# Altium project RunIN MuMux V1R0.PrjPcb
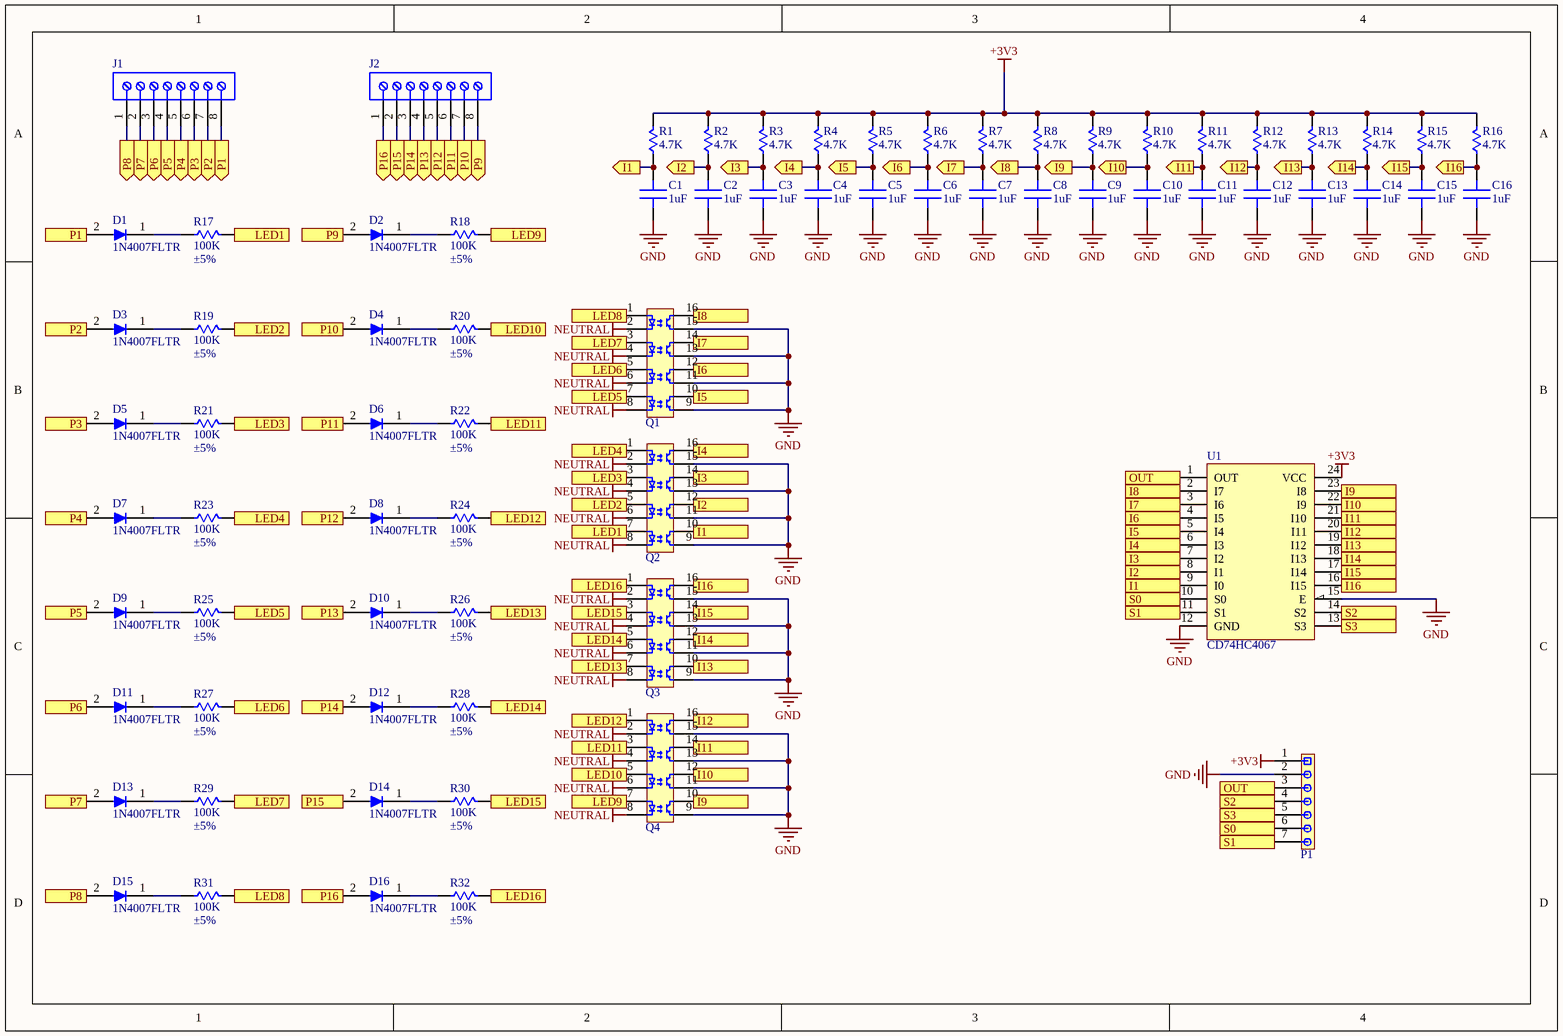
[diagram p0: MuMux V1R0.SchDoc]
1 sheet, 72 parts. Net scope: flat (ports and power ports of the same name join across sheets).
Board file: MuMux V1R0.PcbDoc

## Sheet MuMux V1R0.SchDoc
size A4; SheetNumber: 1; SheetTotal: 1

### Parts
C1  1uF  [0402-CAP]
C2  1uF  [0402-CAP]
C3  1uF  [0402-CAP]
C4  1uF  [0402-CAP]
C5  1uF  [0402-CAP]
C6  1uF  [0402-CAP]
C7  1uF  [0402-CAP]
C8  1uF  [0402-CAP]
C9  1uF  [0402-CAP]
C10  1uF  [0402-CAP]
C11  1uF  [0402-CAP]
C12  1uF  [0402-CAP]
C13  1uF  [0402-CAP]
C14  1uF  [0402-CAP]
C15  1uF  [0402-CAP]
C16  1uF  [0402-CAP]
D1  1N4007FLTR  [SOD-123F]
D2  1N4007FLTR  [SOD-123F]
D3  1N4007FLTR  [SOD-123F]
D4  1N4007FLTR  [SOD-123F]
D5  1N4007FLTR  [SOD-123F]
D6  1N4007FLTR  [SOD-123F]
D7  1N4007FLTR  [SOD-123F]
D8  1N4007FLTR  [SOD-123F]
D9  1N4007FLTR  [SOD-123F]
D10  1N4007FLTR  [SOD-123F]
D11  1N4007FLTR  [SOD-123F]
D12  1N4007FLTR  [SOD-123F]
D13  1N4007FLTR  [SOD-123F]
D14  1N4007FLTR  [SOD-123F]
D15  1N4007FLTR  [SOD-123F]
D16  1N4007FLTR  [SOD-123F]
J1  691210910008  [691210910008]  (value not drawn)
J2  691210910008  [691210910008]  (value not drawn)
P1  M20-9990746  [61300711121]  (value not drawn)
Q1  LTV-846S  [LTV-846S]  (value not drawn)
Q2  LTV-846S  [LTV-846S]  (value not drawn)
Q3  LTV-846S  [LTV-846S]  (value not drawn)
Q4  LTV-846S  [LTV-846S]  (value not drawn)
R1  4.7K  [0402-RES]
R2  4.7K  [0402-RES]
R3  4.7K  [0402-RES]
R4  4.7K  [0402-RES]
R5  4.7K  [0402-RES]
R6  4.7K  [0402-RES]
R7  4.7K  [0402-RES]
R8  4.7K  [0402-RES]
R9  4.7K  [0402-RES]
R10  4.7K  [0402-RES]
R11  4.7K  [0402-RES]
R12  4.7K  [0402-RES]
R13  4.7K  [0402-RES]
R14  4.7K  [0402-RES]
R15  4.7K  [0402-RES]
R16  4.7K  [0402-RES]
R17  100K  Tolerance: ±5%  [FMP200JR-52-100K]
R18  100K  Tolerance: ±5%  [FMP200JR-52-100K]
R19  100K  Tolerance: ±5%  [FMP200JR-52-100K]
R20  100K  Tolerance: ±5%  [FMP200JR-52-100K]
R21  100K  Tolerance: ±5%  [FMP200JR-52-100K]
R22  100K  Tolerance: ±5%  [FMP200JR-52-100K]
R23  100K  Tolerance: ±5%  [FMP200JR-52-100K]
R24  100K  Tolerance: ±5%  [FMP200JR-52-100K]
R25  100K  Tolerance: ±5%  [FMP200JR-52-100K]
R26  100K  Tolerance: ±5%  [FMP200JR-52-100K]
R27  100K  Tolerance: ±5%  [FMP200JR-52-100K]
R28  100K  Tolerance: ±5%  [FMP200JR-52-100K]
R29  100K  Tolerance: ±5%  [FMP200JR-52-100K]
R30  100K  Tolerance: ±5%  [FMP200JR-52-100K]
R31  100K  Tolerance: ±5%  [FMP200JR-52-100K]
R32  100K  Tolerance: ±5%  [FMP200JR-52-100K]
U1  CD74HC4067  [SOIC-24]

### Ports
I1 (in, see MuMux V1R0[2A], MuMux V1R0[2C]), I1 (out, see MuMux V1R0[2A], MuMux V1R0[3C]), I1 (out, see MuMux V1R0[2C], MuMux V1R0[3C]), I2 (in, see MuMux V1R0[2A], MuMux V1R0[2B]), I2 (out, see MuMux V1R0[2A], MuMux V1R0[3C]), I2 (out, see MuMux V1R0[2B], MuMux V1R0[3C]), I3 (in, see MuMux V1R0[2A], MuMux V1R0[2B]), I3 (out, see MuMux V1R0[2A], MuMux V1R0[3C]), I3 (out, see MuMux V1R0[2B], MuMux V1R0[3C]), I4 (in, see MuMux V1R0[2A], MuMux V1R0[2B]), I4 (out, see MuMux V1R0[2A], MuMux V1R0[3C]), I4 (out, see MuMux V1R0[2B], MuMux V1R0[3C]), I5 (in, see MuMux V1R0[2B], MuMux V1R0[3A]), I5 (out, see MuMux V1R0[2B], MuMux V1R0[3C]), I5 (out, see MuMux V1R0[3A], MuMux V1R0[3C]), I6 (in, see MuMux V1R0[2B], MuMux V1R0[3A]), I6 (out, see MuMux V1R0[2B], MuMux V1R0[3C]), I6 (out, see MuMux V1R0[3A], MuMux V1R0[3C]), I7 (in, see MuMux V1R0[2B], MuMux V1R0[3A]), I7 (out, see MuMux V1R0[2B], MuMux V1R0[3B]), I7 (out, see MuMux V1R0[3A], MuMux V1R0[3B]), I8 (in, see MuMux V1R0[2B], MuMux V1R0[3A]), I8 (out, see MuMux V1R0[2B], MuMux V1R0[3B]), I8 (out, see MuMux V1R0[3A], MuMux V1R0[3B]), I9 (in, see MuMux V1R0[2D], MuMux V1R0[3A]), I9 (out, see MuMux V1R0[2D], MuMux V1R0[4B]), I9 (out, see MuMux V1R0[3A], MuMux V1R0[4B]), I10 (in, see MuMux V1R0[2D], MuMux V1R0[3A]), I10 (out, see MuMux V1R0[2D], MuMux V1R0[4B]), I10 (out, see MuMux V1R0[3A], MuMux V1R0[4B]), I11 (in, see MuMux V1R0[2C], MuMux V1R0[3A]), I11 (out, see MuMux V1R0[2C], MuMux V1R0[4C]), I11 (out, see MuMux V1R0[3A], MuMux V1R0[4C]), I12 (in, see MuMux V1R0[2C], MuMux V1R0[4A]), I12 (out, see MuMux V1R0[2C], MuMux V1R0[4C]), I12 (out, see MuMux V1R0[4A], MuMux V1R0[4C]), I13 (in, see MuMux V1R0[2C], MuMux V1R0[4A]), I13 (out, see MuMux V1R0[2C], MuMux V1R0[4C]), I13 (out, see MuMux V1R0[4A], MuMux V1R0[4C]), I14 (in, see MuMux V1R0[2C], MuMux V1R0[4A]), I14 (out, see MuMux V1R0[2C], MuMux V1R0[4C]), I14 (out, see MuMux V1R0[4A], MuMux V1R0[4C]), I15 (in, see MuMux V1R0[2C], MuMux V1R0[4A]), I15 (out, see MuMux V1R0[2C], MuMux V1R0[4C]), I15 (out, see MuMux V1R0[4A], MuMux V1R0[4C]), I16 (in, see MuMux V1R0[2C], MuMux V1R0[4A]), I16 (out, see MuMux V1R0[2C], MuMux V1R0[4C]), I16 (out, see MuMux V1R0[4A], MuMux V1R0[4C]), LED1 (in, see MuMux V1R0[1A]), LED1 (out, see MuMux V1R0[2C]), LED2 (in, see MuMux V1R0[1B]), LED2 (out, see MuMux V1R0[2B]), LED3 (in, see MuMux V1R0[1B]), LED3 (out, see MuMux V1R0[2B]), LED4 (in, see MuMux V1R0[1C]), LED4 (out, see MuMux V1R0[2B]), LED5 (in, see MuMux V1R0[1C]), LED5 (out, see MuMux V1R0[2B]), LED6 (in, see MuMux V1R0[1C]), LED6 (out, see MuMux V1R0[2B]), LED7 (in, see MuMux V1R0[1D]), LED7 (out, see MuMux V1R0[2B]), LED8 (in, see MuMux V1R0[1D]), LED8 (out, see MuMux V1R0[2B]), LED9 (in, see MuMux V1R0[2A]), LED9 (out, see MuMux V1R0[2D]), LED10 (in, see MuMux V1R0[2B]), LED10 (out, see MuMux V1R0[2D]), LED11 (in, see MuMux V1R0[2B]), LED11 (out, see MuMux V1R0[2C]), LED12 (in, see MuMux V1R0[2C]), LED12 (out, see MuMux V1R0[2C]), LED13 (in, see MuMux V1R0[2C]), LED13 (out, see MuMux V1R0[2C]), LED14 (in, see MuMux V1R0[2C]), LED14 (out, see MuMux V1R0[2C]), LED15 (in, see MuMux V1R0[2D]), LED15 (out, see MuMux V1R0[2C]), LED16 (in, see MuMux V1R0[2D]), LED16 (out, see MuMux V1R0[2C]), OUT (out, see MuMux V1R0[3B]), OUT (out, see MuMux V1R0[4D]), P1 (in, see MuMux V1R0[1A]), P1 (out, see MuMux V1R0[1A]), P2 (in, see MuMux V1R0[1A]), P2 (out, see MuMux V1R0[1B]), P3 (in, see MuMux V1R0[1A]), P3 (out, see MuMux V1R0[1B]), P4 (in, see MuMux V1R0[1A]), P4 (out, see MuMux V1R0[1C]), P5 (in, see MuMux V1R0[1A]), P5 (out, see MuMux V1R0[1C]), P6 (in, see MuMux V1R0[1A]), P6 (out, see MuMux V1R0[1C]), P7 (in, see MuMux V1R0[1A]), P7 (out, see MuMux V1R0[1D]), P8 (in, see MuMux V1R0[1A]), P8 (out, see MuMux V1R0[1D]), P9 (in, see MuMux V1R0[2A]), P9 (out, see MuMux V1R0[1A]), P10 (in, see MuMux V1R0[2A]), P10 (out, see MuMux V1R0[1B]), P11 (in, see MuMux V1R0[2A]), P11 (out, see MuMux V1R0[1B]), P12 (in, see MuMux V1R0[2A]), P12 (out, see MuMux V1R0[1C]), P13 (in, see MuMux V1R0[2A]), P13 (out, see MuMux V1R0[1C]), P14 (in, see MuMux V1R0[2A]), P14 (out, see MuMux V1R0[1C]), P15 (in, see MuMux V1R0[2A]), P15 (out, see MuMux V1R0[1D]), P16 (in, see MuMux V1R0[1A]), P16 (out, see MuMux V1R0[1D]), S0 (in, see MuMux V1R0[4D]), S0 (out, see MuMux V1R0[3C]), S1 (in, see MuMux V1R0[4D]), S1 (out, see MuMux V1R0[3C]), S2 (in, see MuMux V1R0[4D]), S2 (out, see MuMux V1R0[4C]), S3 (in, see MuMux V1R0[4D]), S3 (out, see MuMux V1R0[4C])

### Nets
+3V3: P1.1 R1.2 R2.2 R3.2 R4.2 R5.2 R6.2 R7.2 R8.2 R9.2 R10.2 R11.2 R12.2 R13.2 R14.2 R15.2 R16.2 U1.24(VCC)
GND: C1.2 C2.2 C3.2 C4.2 C5.2 C6.2 C7.2 C8.2 C9.2 C10.2 C11.2 C12.2 C13.2 C14.2 C15.2 C16.2 P1.2 Q1.9(E4) Q1.11(E3) Q1.13(E2) Q1.15(E1) Q2.9(E4) Q2.11(E3) Q2.13(E2) Q2.15(E1) Q3.9(E4) Q3.11(E3) Q3.13(E2) Q3.15(E1) Q4.9(E4) Q4.11(E3) Q4.13(E2) Q4.15(E1) U1.12(GND) U1.15(E)
NEUTRAL: Q1.2(K2) Q1.4(K2) Q1.6(K3) Q1.8(K4) Q2.2(K2) Q2.4(K2) Q2.6(K3) Q2.8(K4) Q3.2(K2) Q3.4(K2) Q3.6(K3) Q3.8(K4) Q4.2(K2) Q4.4(K2) Q4.6(K3) Q4.8(K4)
NetC1_1: C1.1 Q2.10(C4) R1.1 U1.9(I0) ; port I1
NetC2_1: C2.1 Q2.12(C3) R2.1 U1.8(I1) ; port I2
NetC3_1: C3.1 Q2.14(C2) R3.1 U1.7(I2) ; port I3
NetC4_1: C4.1 Q2.16(C1) R4.1 U1.6(I3) ; port I4
NetC5_1: C5.1 Q1.10(C4) R5.1 U1.5(I4) ; port I5
NetC6_1: C6.1 Q1.12(C3) R6.1 U1.4(I5) ; port I6
NetC7_1: C7.1 Q1.14(C2) R7.1 U1.3(I6) ; port I7
NetC8_1: C8.1 Q1.16(C1) R8.1 U1.2(I7) ; port I8
NetC9_1: C9.1 Q4.10(C4) R9.1 U1.23(I8) ; port I9
NetC10_1: C10.1 Q4.12(C3) R10.1 U1.22(I9) ; port I10
NetC11_1: C11.1 Q4.14(C2) R11.1 U1.21(I10) ; port I11
NetC12_1: C12.1 Q4.16(C1) R12.1 U1.20(I11) ; port I12
NetC13_1: C13.1 Q3.10(C4) R13.1 U1.19(I12) ; port I13
NetC14_1: C14.1 Q3.12(C3) R14.1 U1.18(I13) ; port I14
NetC15_1: C15.1 Q3.14(C2) R15.1 U1.17(I14) ; port I15
NetC16_1: C16.1 Q3.16(C1) R16.1 U1.16(I15) ; port I16
NetD1_1: D1.1(-) R17.1
NetD1_2: D1.2(+) J1.8 ; port P1
NetD2_1: D2.1(-) R18.1
NetD2_2: D2.2(+) J2.8 ; port P9
NetD3_1: D3.1(-) R19.1
NetD3_2: D3.2(+) J1.7 ; port P2
NetD4_1: D4.1(-) R20.1
NetD4_2: D4.2(+) J2.7 ; port P10
NetD5_1: D5.1(-) R21.1
NetD5_2: D5.2(+) J1.6 ; port P3
NetD6_1: D6.1(-) R22.1
NetD6_2: D6.2(+) J2.6 ; port P11
NetD7_1: D7.1(-) R23.1
NetD7_2: D7.2(+) J1.5 ; port P4
NetD8_1: D8.1(-) R24.1
NetD8_2: D8.2(+) J2.5 ; port P12
NetD9_1: D9.1(-) R25.1
NetD9_2: D9.2(+) J1.4 ; port P5
NetD10_1: D10.1(-) R26.1
NetD10_2: D10.2(+) J2.4 ; port P13
NetD11_1: D11.1(-) R27.1
NetD11_2: D11.2(+) J1.3 ; port P6
NetD12_1: D12.1(-) R28.1
NetD12_2: D12.2(+) J2.3 ; port P14
NetD13_1: D13.1(-) R29.1
NetD13_2: D13.2(+) J1.2 ; port P7
NetD14_1: D14.1(-) R30.1
NetD14_2: D14.2(+) J2.2 ; port P15
NetD15_1: D15.1(-) R31.1
NetD15_2: D15.2(+) J1.1 ; port P8
NetD16_1: D16.1(-) R32.1
NetD16_2: D16.2(+) J2.1 ; port P16
NetP1_3: P1.3 U1.1(OUT) ; port OUT
NetP1_4: P1.4 U1.14(S2) ; port S2
NetP1_5: P1.5 U1.13(S3) ; port S3
NetP1_6: P1.6 U1.10(S0) ; port S0
NetP1_7: P1.7 U1.11(S1) ; port S1
NetQ1_1: Q1.1(A1) R31.2 ; port LED8
NetQ1_3: Q1.3(A2) R29.2 ; port LED7
NetQ1_5: Q1.5(A3) R27.2 ; port LED6
NetQ1_7: Q1.7(A4) R25.2 ; port LED5
NetQ2_1: Q2.1(A1) R23.2 ; port LED4
NetQ2_3: Q2.3(A2) R21.2 ; port LED3
NetQ2_5: Q2.5(A3) R19.2 ; port LED2
NetQ2_7: Q2.7(A4) R17.2 ; port LED1
NetQ3_1: Q3.1(A1) R32.2 ; port LED16
NetQ3_3: Q3.3(A2) R30.2 ; port LED15
NetQ3_5: Q3.5(A3) R28.2 ; port LED14
NetQ3_7: Q3.7(A4) R26.2 ; port LED13
NetQ4_1: Q4.1(A1) R24.2 ; port LED12
NetQ4_3: Q4.3(A2) R22.2 ; port LED11
NetQ4_5: Q4.5(A3) R20.2 ; port LED10
NetQ4_7: Q4.7(A4) R18.2 ; port LED9

### Library data of the parts
C1-C16 = GRM155Z71A105KE01J: CAP CER 1UF 10V X7R 0402; Manufacturer: Murata; Supplier 1: Digi-Key; Manufacturer Part Number: GRM155Z71A105KE01J; RoHS: Yes; Category: Ceramic Capacitors; Stock 1: 272858; Pricing 1: 1=0,1, 10=0,063, 50=0,0344, 100=0,0281, 500=0,02006, 1000=0,01577, 2500=0,01433, 5000=0,01319 (USD); Supplier Part Number 1: 490-GRM155Z71A105KE01JCT-ND
D1-D16 = 1N4007FLTR_1: STANDARD RECTIFIER 1000V SOD-123; Manufacturer 1: Sangdest Microelectronics; Supplier 1: Digi-Key; Manufacturer Part Number 1: 1N4007FLTR; Stock 1: 6969; Pricing 1: 1=0,10000, 10=0,06600, 100=0,03120, 500=0,01848, 1000=0,01214 (USD); RoHS: No; Supplier Part Number 1: 1655-1N4007FLCT-ND
J1 J2 = CMP-1502-02461-2: NexarPartId: 105950654
P1 = M20-9990746: CONN HEADER VERT 7POS 2.54MM; Manufacturer: Harwin; Max Current Rating: 3A; Contact Resistance: 30mR; Number of Positions: 7; Connector Type: Male Pin; Supplier 1: Digi-Key; Manufacturer Part Number: M20-9990746; Stock 1: 1005; Pricing 1: 1 = 0,28000, 10 = 0,25900, 100 = 0,17940, 500 = 0,15180, 1000 = 0,12420, 5000 = 0,11040, 10000 = 0,10005 (USD); RoHS: Yes; Mount: Through Hole; Case/Package: SIL; Contact Plating: Tin; Color: Black; Contact Material: Brass; Housing Color: Black; Housing Material: Nylon; Min Operating Temperature: -40°C; Max Operating Temperature: 105°C; Packaging: Bulk; Package Quantity: 1000; Termination: Solder; Number of Rows: 1; Orientation: Straight; Length: 17.78mm; Pitch: 2.54mm; Contact Mating Length: 0.24inch; Depth: 2.54mm; ComponentLink1URL: https://datasheet.ciiva.com/5160/m20-999-351179-5160169.pdf?src-supplier=Mouser; ComponentLink1Description: https://datasheet.ciiva.com/5160/m20-999-351179-5160169.pdf?src-supplier=Mouser; ComponentLink2URL: https://datasheet.ciiva.com/6817/m20-999-6817978.pdf?src-supplier=Digi-Key; ComponentLink2Description: https://datasheet.ciiva.com/6817/m20-999-6817978.pdf?src-supplier=Digi-Key; Supplier Part Number 1: 952-3301-ND
Q1-Q4 = LTV-846S: OPTOISO 5KV 4CH TRANS 16-SMD; Manufacturer: Lite-On Inc.; Voltage - Isolation: 5000Vrms; Current Transfer Ratio (Min): 50% @ 5mA; Current Transfer Ratio (Max): 600% @ 5mA; Rise / Fall Time (Typ): 4µs, 3µs; Input Type: DC; Output Type: Transistor; Voltage - Output (Max): 80V; Current - Output / Channel: 50mA; Voltage - Forward (Vf) (Typ): 1.2V; Vce Saturation (Max): 200mV; Supplier 1: Digi-Key; Manufacturer Part Number: LTV-846S; RoHS: RoHS Compliant; Category: Isolators; Stock 1: 48684; Pricing 1: 1=1.02, 10=0.825, 25=0.6344, 100=0.5711, 250=0.5076, 500=0.43146, 1000=0.35532, 2500=0.33756, 5000=0.32994 (USD); Packaging: Tube; Part Status: Active; Turn On / Turn Off Time (Typ): -; Operating Temperature: -30°C ~ 100°C; Mounting Type: Surface Mount; Package / Case: 16-SMD, Gull Wing; Supplier Device Package: 16-SMD; ComponentLink1URL: https://media.digikey.com/pdf/Data%20Sheets/Lite-On%20PDFs/LTV-816_826_846.pdf; ComponentLink1Description: https://media.digikey.com/pdf/Data%20Sheets/Lite-On%20PDFs/LTV-816_826_846.pdf; Supplier Part Number 1: 160-1365-5-ND
R1-R16 = RMCF0402JT4K70: RES SMD 4.7K OHM 5% 1/16W 0402; Manufacturer: Stackpole Electronics; CTA Part Number: 101000318; Resistance: 4.7kR; Power Rating: 63mW; Temperature Coefficient: 100ppm/°C; Supplier 1: Digi-Key; Manufacturer Part Number: RMCF0402JT4K70; RoHS: Yes; Category: Chip SMD Resistors; Pricing 1: 1=0,10000, 10=0,01200, 100=0,00470, 1000=0,00213, 2500=0,00185, 5000=0,00153 (USD); Mount: Surface Mount; Case/Package: 0402; Case Code (Metric): 1005; Case Code (Imperial): 0402; Contact Plating: Tin,Matte; Min Operating Temperature: -55°C; Max Operating Temperature: 155°C; Tolerance: 5%; Packaging: Tape and Reel; Resistor Type: Thick Film; Number of Terminations: 2; Max Power Dissipation: 63mW; Features: Automotive AEC-Q200; Series: RMCF; Construction: Rectangular; Length: 0.039inch; Width: 0.02inch; Height: 0.016inch; Depth: 0.5mm; Radiation Hardening: No; Lead Free: Lead Free; Military Standard: Not; RoHS Compliant: Yes; ComponentLink1URL: http://components.arrow.com/part/dataview/50582671S6490608N1174?src-supplier=Arrow+Electronics; ComponentLink1Description: http://components.arrow.com/part/dataview/50582671S6490608N1174?src-supplier=Arrow+Electronics; ComponentLink2URL: https://www.seielect.com/catalog/sei-rmcf_rmcp.pdf?src-supplier=Digi-Key; ComponentLink2Description: https://www.seielect.com/catalog/sei-rmcf_rmcp.pdf?src-supplier=Digi-Key; ComponentLink3URL: https://www.seielect.com/catalog/SEI-RMCF_RMCP.pdf?src-supplier=Avnet; ComponentLink3Description: https://www.seielect.com/catalog/SEI-RMCF_RMCP.pdf?src-supplier=Avnet; Supplier Part Number 1: RMCF0402JT4K70CT-ND
R17-R32 = FMP200JR-52-100K: RES SMD 100K OHM 2W 5% AXIAL; Manufacturer: Yageo; Supplier 1: Digi-Key; Manufacturer Part Number: FMP200JR-52-100K; RoHS: RoHS Compliant; Category: Resistors; Stock 1: 62500; Pricing 1: 2500=0.02251, 5000=0.02046, 12500=0.0191, 25000=0.01814, 62500=0.01777, 125000=0.01739 (USD); Packaging: Tape & Reel (TR); Part Status: Active; Power (Watts): 2W; Composition: Metal Film; Features: Flame Proof, Safety; Temperature Coefficient: -; Operating Temperature: -55°C ~ 155°C; Package / Case: Axial; Supplier Device Package: Axial; Size / Dimension: 0.154" Dia x 0.354" L (3.90mm x 9.00mm); Height - Seated (Max): -; Failure Rate: -; ComponentLink1URL: http://www.yageo.com/documents/recent/Yageo%20LR_FMP_2013.pdf; ComponentLink1Description: http://www.yageo.com/documents/recent/Yageo%20LR_FMP_2013.pdf; Supplier Part Number 1: 100KZTR-ND
U1 = CD74HC4067: IC MUX/DEMUX 16X1 24SOIC; Manufacturer 1: Texas Instruments; Manufacturer Part  1: CD74HCT4067ME4; Bandwidth: 89MHz; Propagation Delay: 15ns; Number of Channels: 1; Min Supply Voltage: 4.5V; Max Supply Voltage: 5.5V; Nominal Supply Current: 8uA; Number of Bits: 16; Low Level Output Current: 25mA; ComponentLink1URL: https://datasheet.ciiva.com/15092/getdatasheetpartid-517315-15092547.pdf?src-supplier=Verical; ComponentLink1Description: https://datasheet.ciiva.com/15092/getdatasheetpartid-517315-15092547.pdf?src-supplier=Verical; ComponentLink2URL: https://datasheet.ciiva.com/6619/cd4514b-6619129.pdf?src-supplier=Digi-Key; ComponentLink2Description: https://datasheet.ciiva.com/6619/cd4514b-6619129.pdf?src-supplier=Digi-Key; ComponentLink3URL: https://datasheet.ciiva.com/6619/cd4514b-6619130.pdf?src-supplier=Digi-Key; ComponentLink3Description: https://datasheet.ciiva.com/6619/cd4514b-6619130.pdf?src-supplier=Digi-Key; ComponentLink4URL: https://datasheet.ciiva.com/6619/cd4514b-6619131.pdf?src-supplier=Digi-Key; ComponentLink4Description: https://datasheet.ciiva.com/6619/cd4514b-6619131.pdf?src-supplier=Digi-Key; ComponentLink5URL: https://datasheet.ciiva.com/14294/cd4515b-mil-14294557.pdf?src-supplier=Avnet; ComponentLink5Description: https://datasheet.ciiva.com/14294/cd4515b-mil-14294557.pdf?src-supplier=Avnet; ComponentLink6URL: https://datasheet.ciiva.com/28433/cd4515b-mil-28433832.pdf?src-supplier=Avnet+Europe; ComponentLink6Description: https://datasheet.ciiva.com/28433/cd4515b-mil-28433832.pdf?src-supplier=Avnet+Europe; Supplier 1: Arrow Electronics; RoHS: Yes; Category: Interface ICs; Pricing 1: 1000=0,4986, 2000=0,4936, 3000=0,4887, 4000=0,4838, 5000=0,479, 10000=0,4742, 20000=0,4694, 25000=0,4647, 50000=0,4601 (USD); Mounting Technology: Surface Mount; Case/Package: SOIC; Pins: 24; Weight: 0.022025oz; Contact Plating: Gold; Min Operating Temperature: -55°C; Max Operating Temperature: 125°C; Packaging: Rail/Tube; Package Quantity: 25; Series: -; High Level Output Current: 25mA; Number of Circuits: 1; -3db Bandwidth: 89MHz; Operating Supply Current: 8uA; RoHS Compliant: Yes; Lead Free: Lead Free; ComponentLink7URL: http://components.arrow.com/part/dataview/41680261S405991N2413?src-supplier=Arrow+Electronics; ComponentLink7Description: http://components.arrow.com/part/dataview/41680261S405991N2413?src-supplier=Arrow+Electronics; ComponentLink8URL: http://www.ti.com/general/docs/suppproductinfo.tsp?distId=10&amp;gotoUrl=http%3A%2F%2Fwww.ti.com%2Flit%2Fgpn%2Fcd74hct4067&src-supplier=Digikey; ComponentLink8Description: http://www.ti.com/general/docs/suppproductinfo.tsp?distId=10&amp;gotoUrl=http%3A%2F%2Fwww.ti.com%2Flit%2Fgpn%2Fcd74hct4067&src-supplier=Digikey; ComponentLink9URL: http://www.ti.com/general/docs/lit/getliterature.tsp?genericPartNumber=CD74HCT4067&&fileType=pdf&src-supplier=Avnet; ComponentLink9Description: http://www.ti.com/general/docs/lit/getliterature.tsp?genericPartNumber=CD74HCT4067&&fileType=pdf&src-supplier=Avnet; ComponentLink10URL: http://www.ti.com/lit/gpn/cd74hct4067?src-supplier=Mouser; ComponentLink10Description: http://www.ti.com/lit/gpn/cd74hct4067?src-supplier=Mouser; Supplier Part Number 1: CD74HCT4067ME4